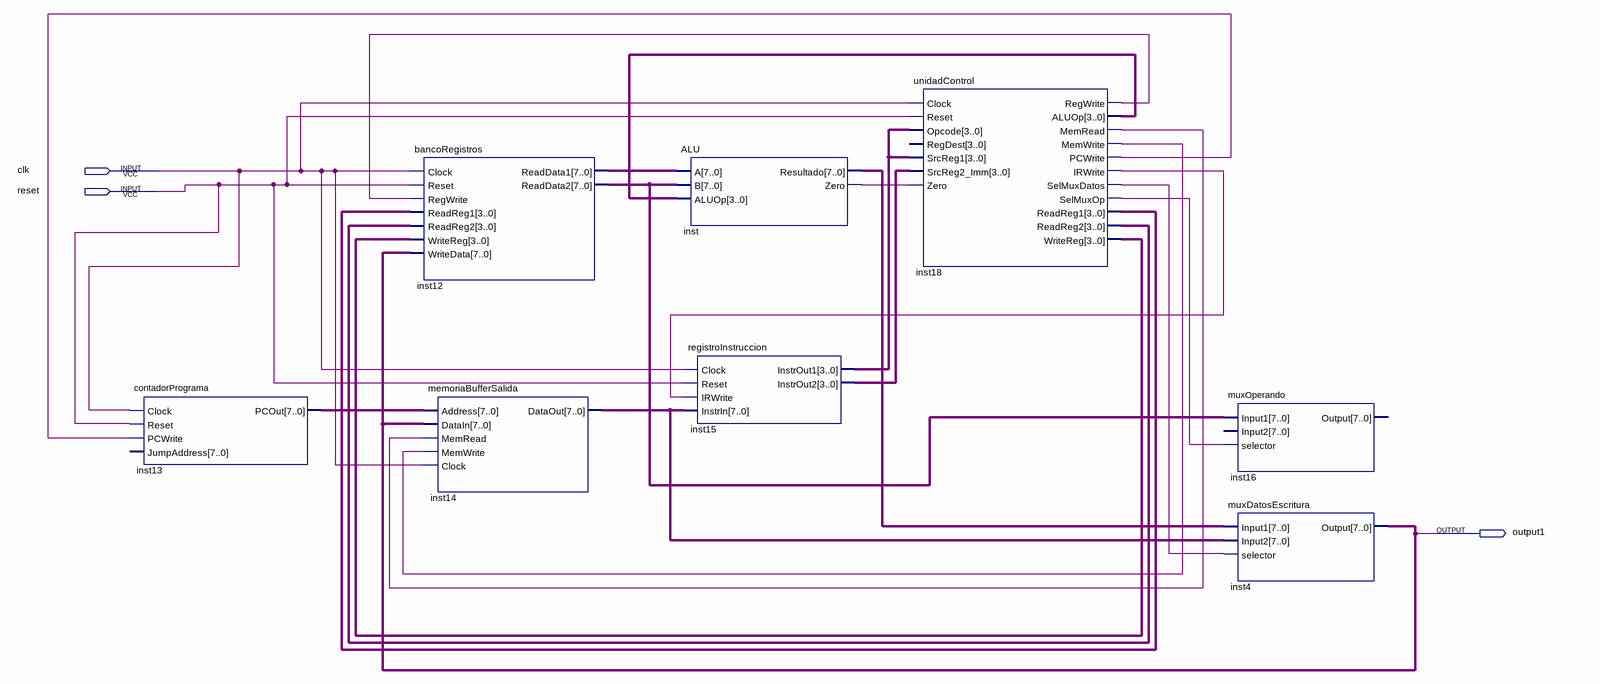
[diagram p0: schematic sheet]
// Quartus schematic uControlador.bdf as structural Verilog: 8 symbols, 3 pins
module uControlador (
  input  clk,
  input  reset,
  output output1
);

  wire inst18_irwrite, inst18_memread, inst18_memwrite, inst18_pcwrite, inst18_regwrite, inst18_selmuxdatos,
       inst18_selmuxop, inst_zero;
  wire [3:0] inst15_instrout1, inst15_instrout2, inst18_aluop, inst18_readreg1, inst18_readreg2,
       inst18_writereg;
  wire [7:0] inst4_output, inst12_readdata1, inst12_readdata2, inst13_pcout, inst14_dataout, inst_resultado;

  contadorPrograma inst13 (
    .Clock(clk), .Reset(reset), .PCWrite(inst18_pcwrite), .PCOut(inst13_pcout));  // open: JumpAddress
  bancoRegistros inst12 (
    .Clock(clk), .Reset(reset), .RegWrite(inst18_regwrite), .ReadReg1(inst18_readreg1),
    .ReadReg2(inst18_readreg2), .WriteReg(inst18_writereg), .WriteData(inst4_output),
    .ReadData1(inst12_readdata1), .ReadData2(inst12_readdata2));
  memoriaBufferSalida inst14 (
    .Address(inst13_pcout), .DataIn(inst4_output), .MemRead(inst18_memread), .MemWrite(inst18_memwrite),
    .Clock(clk), .DataOut(inst14_dataout));
  ALU inst (
    .A(inst12_readdata1), .B(inst12_readdata2), .ALUOp(inst18_aluop), .Resultado(inst_resultado),
    .Zero(inst_zero));
  registroInstruccion inst15 (
    .Clock(clk), .Reset(reset), .IRWrite(inst18_irwrite), .InstrIn(inst14_dataout),
    .InstrOut1(inst15_instrout1), .InstrOut2(inst15_instrout2));
  unidadControl inst18 (
    .Clock(clk), .Reset(reset), .Opcode(inst15_instrout1), .SrcReg1(inst15_instrout1),
    .SrcReg2_Imm(inst15_instrout2), .Zero(inst_zero), .RegWrite(inst18_regwrite), .ALUOp(inst18_aluop),
    .MemRead(inst18_memread), .MemWrite(inst18_memwrite), .PCWrite(inst18_pcwrite), .IRWrite(inst18_irwrite),
    .SelMuxDatos(inst18_selmuxdatos), .SelMuxOp(inst18_selmuxop), .ReadReg1(inst18_readreg1),
    .ReadReg2(inst18_readreg2), .WriteReg(inst18_writereg));  // open: RegDest
  muxOperando inst16 (.Input1(inst12_readdata2), .selector(inst18_selmuxop));  // open: Input2, Output
  muxDatosEscritura inst4 (
    .Input1(inst_resultado), .Input2(inst14_dataout), .selector(inst18_selmuxdatos), .Output(inst4_output));
endmodule
